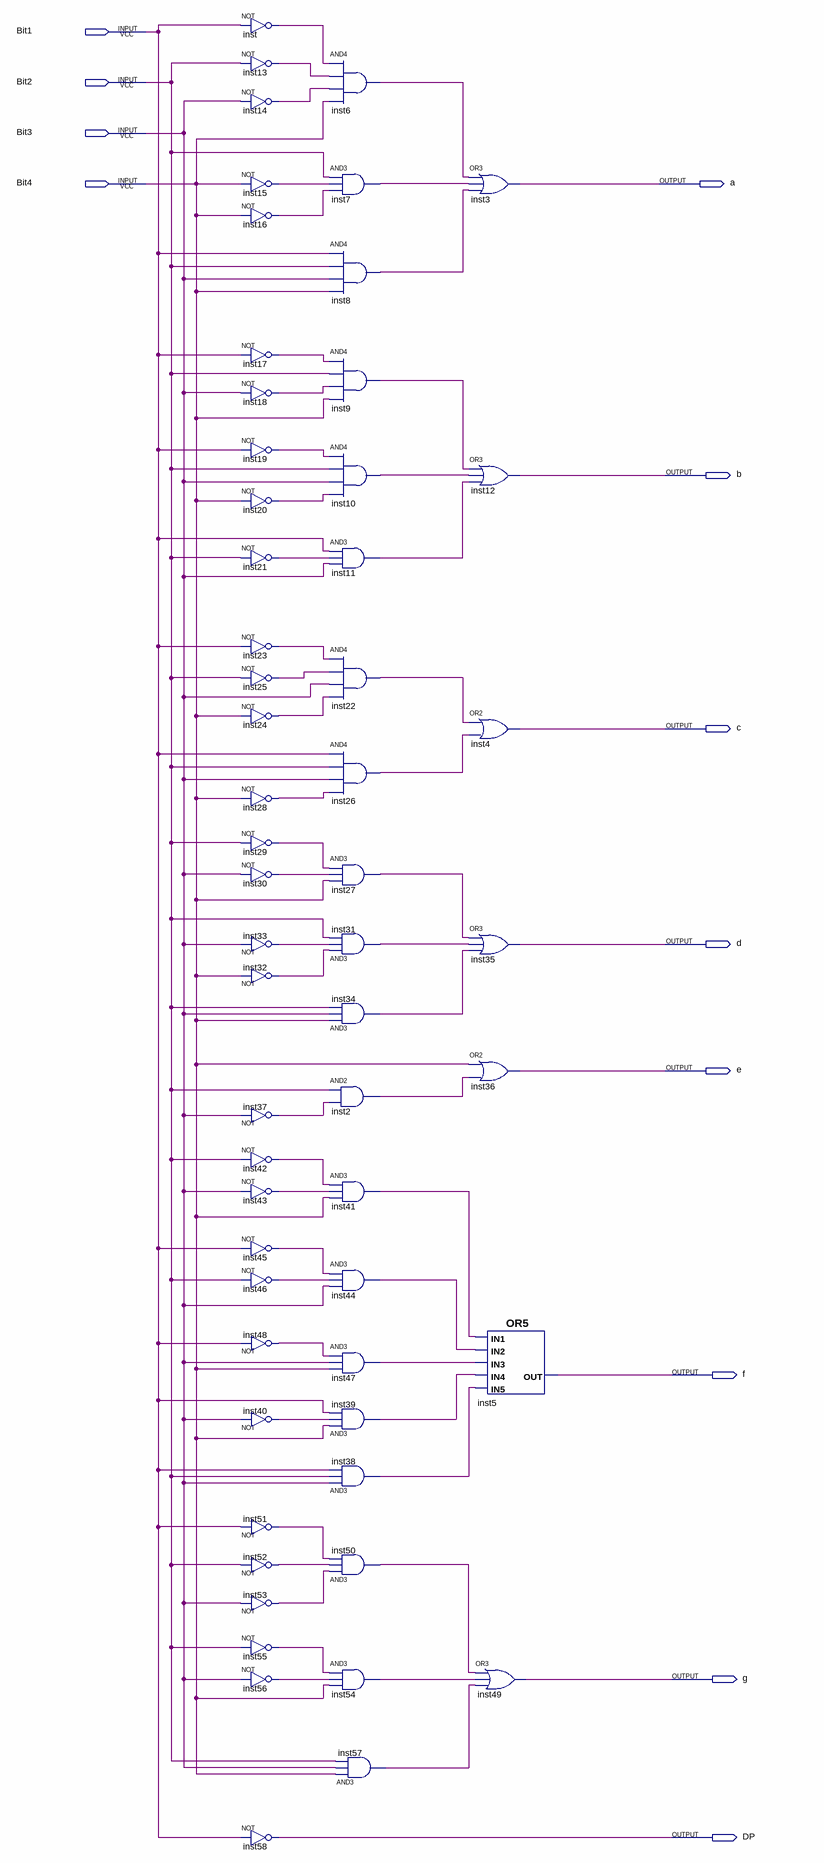
[diagram p0: schematic sheet]
// Quartus schematic decodificadorOperando.bdf as structural Verilog: 58 symbols, 12 pins
module decodificadorOperando (
  input  Bit1,
  input  Bit2,
  input  Bit3,
  input  Bit4,
  output a,
  output b,
  output c,
  output d,
  output e,
  output f,
  output g,
  output DP
);

  wire inst2_out, inst6_out, inst7_out, inst8_out, inst9_out, inst10_out, inst11_out, inst13_out, inst14_out,
       inst15_out, inst16_out, inst17_out, inst18_out, inst19_out, inst20_out, inst21_out, inst22_out,
       inst23_out, inst24_out, inst25_out, inst26_out, inst27_out, inst28_out, inst29_out, inst30_out,
       inst31_out, inst32_out, inst33_out, inst34_out, inst37_out, inst38_out, inst39_out, inst40_out,
       inst41_out, inst42_out, inst43_out, inst44_out, inst45_out, inst46_out, inst47_out, inst48_out,
       inst50_out, inst51_out, inst52_out, inst53_out, inst54_out, inst55_out, inst56_out, inst57_out,
       inst_out;

  not inst (inst_out, Bit1);
  not inst13 (inst13_out, Bit2);
  not inst14 (inst14_out, Bit3);
  not inst15 (inst15_out, Bit4);
  not inst16 (inst16_out, Bit4);
  not inst17 (inst17_out, Bit1);
  not inst18 (inst18_out, Bit3);
  not inst19 (inst19_out, Bit1);
  not inst20 (inst20_out, Bit4);
  not inst21 (inst21_out, Bit2);
  not inst23 (inst23_out, Bit1);
  not inst25 (inst25_out, Bit2);
  not inst24 (inst24_out, Bit4);
  not inst28 (inst28_out, Bit4);
  not inst29 (inst29_out, Bit2);
  not inst30 (inst30_out, Bit3);
  not inst33 (inst33_out, Bit3);
  not inst32 (inst32_out, Bit4);
  not inst37 (inst37_out, Bit3);
  not inst42 (inst42_out, Bit2);
  not inst43 (inst43_out, Bit3);
  not inst45 (inst45_out, Bit1);
  not inst46 (inst46_out, Bit2);
  not inst48 (inst48_out, Bit1);
  not inst40 (inst40_out, Bit3);
  not inst51 (inst51_out, Bit1);
  not inst52 (inst52_out, Bit2);
  not inst53 (inst53_out, Bit3);
  not inst55 (inst55_out, Bit2);
  not inst56 (inst56_out, Bit3);
  not inst58 (DP, Bit1);
  and inst6 (inst6_out, inst_out, inst13_out, inst14_out, Bit4);
  and inst7 (inst7_out, Bit2, inst15_out, inst16_out);
  and inst8 (inst8_out, Bit1, Bit2, Bit3, Bit4);
  and inst9 (inst9_out, inst17_out, Bit2, inst18_out, Bit4);
  and inst10 (inst10_out, inst19_out, Bit2, Bit3, inst20_out);
  and inst11 (inst11_out, Bit1, inst21_out, Bit3);
  and inst22 (inst22_out, inst23_out, inst25_out, Bit3, inst24_out);
  and inst26 (inst26_out, Bit1, Bit2, Bit3, inst28_out);
  and inst27 (inst27_out, inst29_out, inst30_out, Bit4);
  and inst31 (inst31_out, inst32_out, inst33_out, Bit2);
  and inst34 (inst34_out, Bit4, Bit3, Bit2);
  and inst2 (inst2_out, Bit2, inst37_out);
  and inst41 (inst41_out, inst42_out, inst43_out, Bit4);
  and inst44 (inst44_out, inst45_out, inst46_out, Bit3);
  and inst47 (inst47_out, inst48_out, Bit3, Bit4);
  and inst39 (inst39_out, Bit4, inst40_out, Bit1);
  and inst38 (inst38_out, Bit3, Bit2, Bit1);
  and inst50 (inst50_out, inst53_out, inst52_out, inst51_out);
  and inst54 (inst54_out, inst55_out, inst56_out, Bit4);
  and inst57 (inst57_out, Bit4, Bit3, Bit2);
  or inst3 (a, inst6_out, inst7_out, inst8_out);
  or inst12 (b, inst9_out, inst10_out, inst11_out);
  or inst4 (c, inst22_out, inst26_out);
  or inst35 (d, inst27_out, inst31_out, inst34_out);
  or inst36 (e, Bit4, inst2_out);
  or inst5 (f, inst41_out, inst44_out, inst47_out, inst39_out, inst38_out);
  or inst49 (g, inst50_out, inst54_out, inst57_out);
endmodule
